# Altium schematic sheet SafeBox(w5100s).SchDoc
size 330 x 241 mm
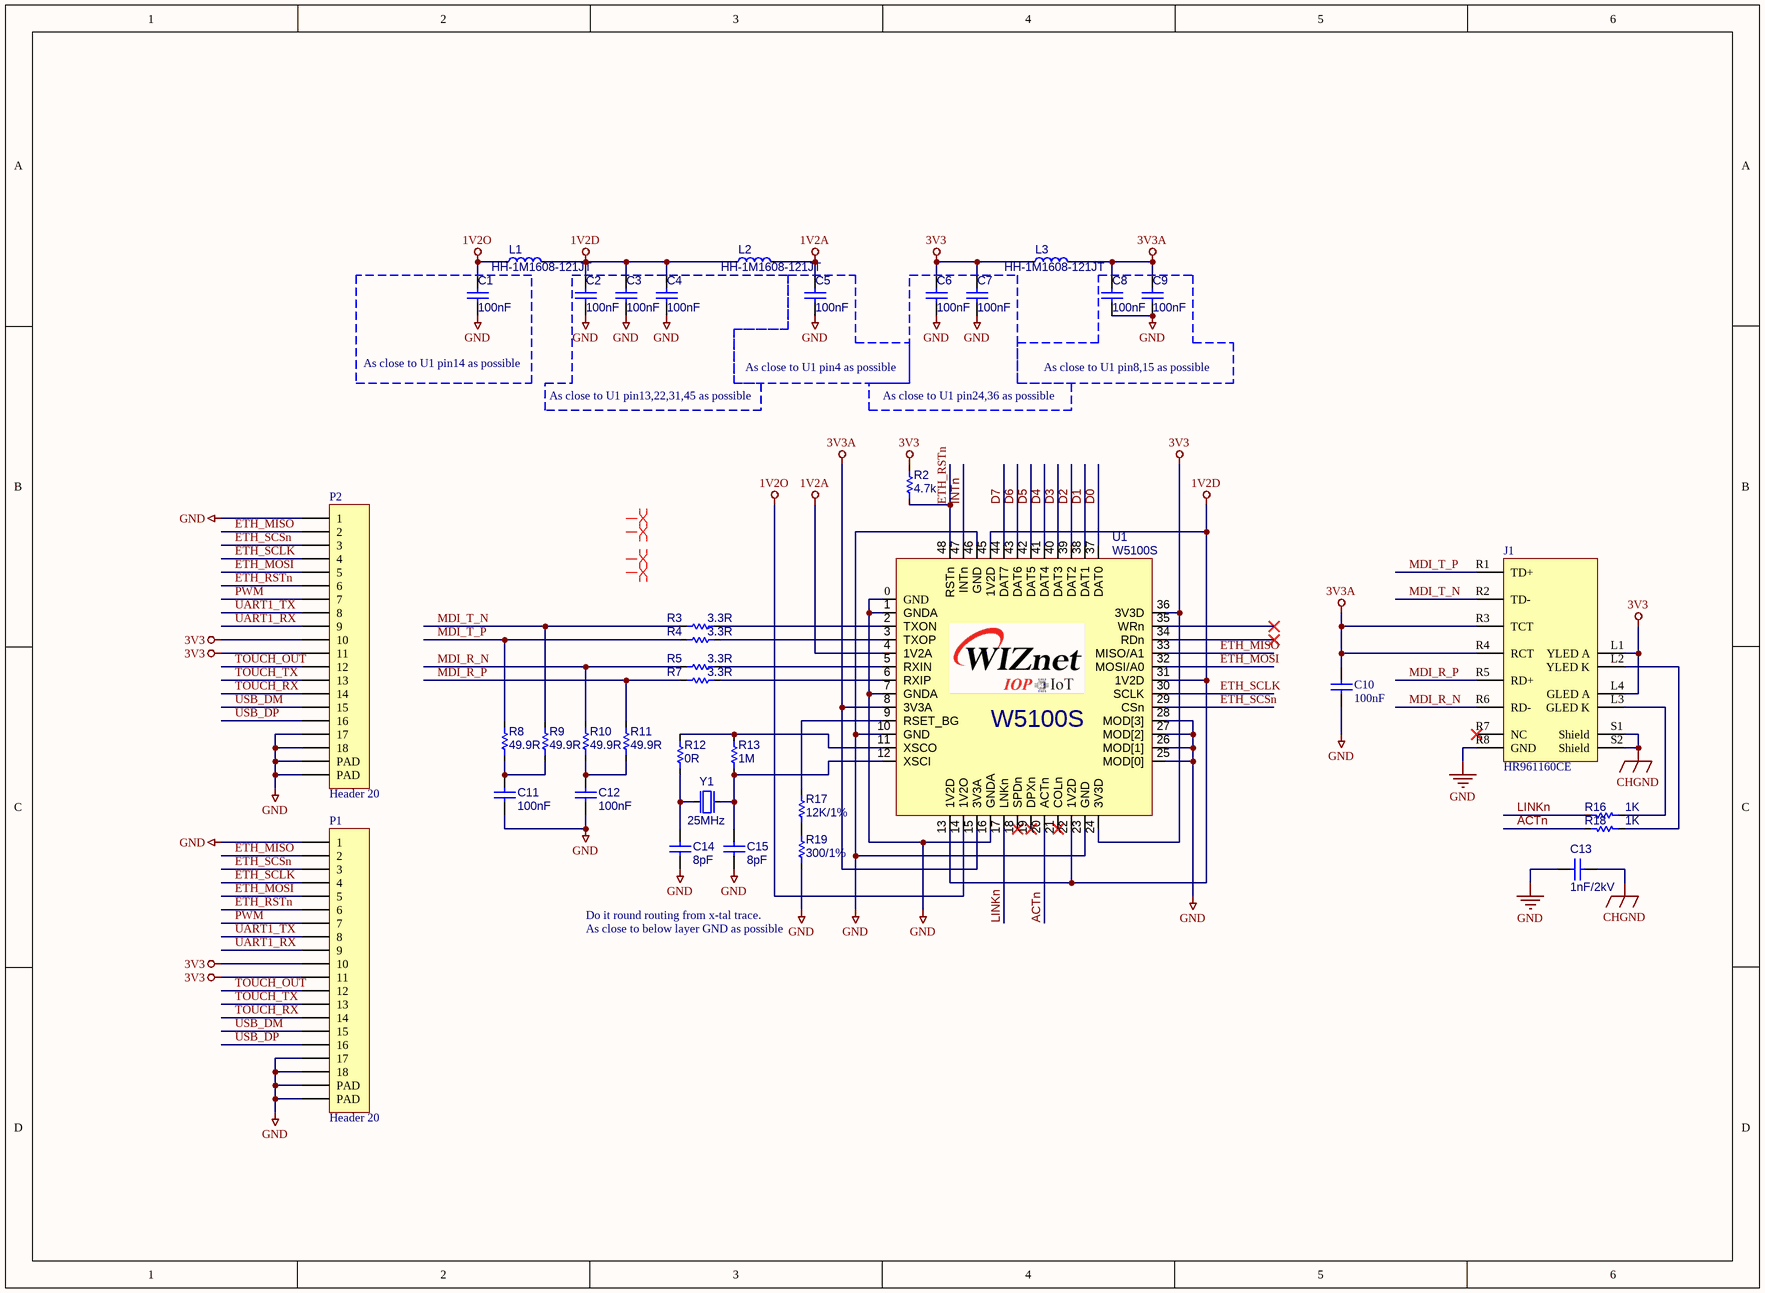
[diagram p0: SafeBox(w5100s).SchDoc]

## Parts
C1  100nF  [0603-C]
C2  100nF  [0603-C]
C3  100nF  [0603-C]
C4  100nF  [0603-C]
C5  100nF  [0603-C]
C6  100nF  [0603-C]
C7  100nF  [0603-C]
C8  100nF  [0603-C]
C9  100nF  [0603-C]
C10  value 100nF  [0603-C]  (hidden comment: Cap)
C11  100nF  [0603-C]
C12  100nF  [0603-C]
C13  1nF/2kV  [CAP-1206]
C14  8pF  [0603-C]
C15  8pF  [0603-C]
J1  HR961160CE  [RJ-45(HR961160CE) - duplicate]
L1  HH-1M1608-121JT  [0603-L]
L2  HH-1M1608-121JT  [0603-L]
L3  HH-1M1608-121JT  [0603-L]
P1  Header 20  [FPC_18PIN]
P2  Header 20  [FPC_18PIN]
R2  4.7k  [0603-R]
R3  3.3R  [0603-R]
R4  3.3R  [0603-R]
R5  3.3R  [0603-R]
R7  3.3R  [0603-R]
R8  49.9R  [0603-R]
R9  49.9R  [0603-R]
R10  49.9R  [0603-R]
R11  49.9R  [0603-R]
R12  0R  [0603-R]
R13  1M  [0603-R]
R16  1K  [0603-R]
R17  12K/1%  [RES-0603]
R18  1K  [0603-R]
R19  300/1%  [RES-0603]
U1  W5100S  [WIZNET W5100S QFN]
Y1  25MHz  [OSC-82J0626]

## Blocks framed on the sheet
As close to U1 pin14 as possible: C1
As close to U1 pin13,22,31,45 as possible: C2-C4
As close to U1 pin4 as possible: C5
As close to U1 pin24,36 as possible: C6 C7
As close to U1 pin8,15 as possible: C8 C9

## Nets
1V2A: C5.2 L2.2 U1.4(1V2A)
1V2D: C2.2 C3.2 C4.2 L1.2 L2.1 U1.13(1V2D) U1.22(1V2D) U1.31(1V2D) U1.45(1V2D)
1V2O: C1.2 L1.1 U1.14(1V2O)
3V3: C6.2 C7.2 J1.L1(YLED_A) J1.L4(GLED_A) L3.1 P1.10 P1.11 P2.10 P2.11 R2.2 U1.24(3V3D) U1.36(3V3D)
3V3A: C8.2 C9.2 C10.1 J1.R3(TCT) J1.R4(RCT) L3.2 U1.8(3V3A) U1.15(3V3A)
CHGND: C13.1 J1.S1(Shield) J1.S2(Shield)
GND: C1.1 C2.1 C3.1 C4.1 C5.1 C6.1 C7.1 C8.1 C9.1 C10.2 C11.1 C12.1 C13.2 C14.1 C15.1 J1.R8(GND) P1.1 P1.17 P1.18 P1.19(PAD) P1.20(PAD) P2.1 P2.17 P2.18 P2.19(PAD) P2.20(PAD) R19.1 U1.0(GND) U1.1(GNDA) U1.7(GNDA) U1.10(GND) U1.16(GNDA) U1.23(GND) U1.25(MOD[0]) U1.26(MOD[1]) U1.27(MOD[2]) U1.28(MOD[3]) U1.46(GND) Y1.2(GND) Y1.4(GND)
ACTn: R18.1 U1.20(ACTn)
D0: U1.37(DAT0)
D1: U1.38(DAT1)
D2: U1.39(DAT2)
D3: U1.40(DAT3)
D4: U1.41(DAT4)
D5: U1.42(DAT5)
D6: U1.43(DAT6)
D7: U1.44(DAT7)
ETH_MISO: P1.2 P2.2 U1.33(MISO/A1)
ETH_MOSI: P1.5 P2.5 U1.32(MOSI/A0)
ETH_RSTn: P1.6 P2.6 R2.1 U1.48(RSTn)
ETH_SCLK: P1.4 P2.4 U1.30(SCLK)
ETH_SCSn: P1.3 P2.3 U1.29(CSn)
INTn: U1.47(INTn)
LINKn: R16.1 U1.17(LNKn)
MDI_R_N: J1.R6(RD-) R5.2 R10.2
MDI_R_P: J1.R5(RD+) R7.2 R11.2
MDI_T_N: J1.R2(TD-) R3.2 R9.2
MDI_T_P: J1.R1(TD+) R4.2 R8.2
PWM: P1.7 P2.7
TOUCH_OUT: P1.12 P2.12
TOUCH_RX: P1.14 P2.14
TOUCH_TX: P1.13 P2.13
UART1_RX: P1.9 P2.9
UART1_TX: P1.8 P2.8
USB_DM: P1.15 P2.15
USB_DP: P1.16 P2.16
NetC11_2: C11.2 R8.1 R9.1
NetC12_2: C12.2 R10.1 R11.1
NetC14_2: C14.2 R12.1 Y1.1(inp)
NetC15_2: C15.2 R13.1 U1.12(XSCI) Y1.3(out)
NetJ1_L2: J1.L2(YLED_K) R18.2
NetJ1_L3: J1.L3(GLED_K) R16.2
NetR3_1: R3.1 U1.2(TXON)
NetR4_1: R4.1 U1.3(TXOP)
NetR5_1: R5.1 U1.5(RXIN)
NetR7_1: R7.1 U1.6(RXIP)
NetR12_2: R12.2 R13.2 U1.11(XSCO)
NetR17_1: R17.1 R19.2
NetR17_2: R17.2 U1.9(RSET_BG)

Not connected (* = marked no-connect by the designer): J1 R7(NC)*; U1 18(SPDn)* 19(DPXn)* 21(COLn)* 34(RDn)* 35(WRn)*

## Layout directives
differential pair: (no net found under the mark)

## Notes on the sheet
- Do it round routing from x-tal trace.
- As close to below layer GND as possible

## Library data of the parts
C1-C9 C11 C12 C14 C15 = CAP-0603: Ceramic CAP 0603(1608)
C10 = Cap: Capacitor; Published: 8-Jun-2000; LatestRevisionDate: 17-Jul-2002; LatestRevisionNote: Re-released for DXP Platform.; PackageReference: RAD-0.3; Publisher: Altium Limited
C13 = CAP-1808: Ceramic CAP 1808(4520)
J1 = BS-R250210
L1-L3 = IND-0603: Inductor 0603(1608)
P1 P2 = Header 20: Header, 20-Pin; LatestRevisionDate: 17-Jul-2002; LatestRevisionNote: Re-released for DXP Platform.; Publisher: Altium Limited
R2-R5 R7-R13 R16-R19 = RES-0603: RES0603
U1 = W5100S: WIZnet Hardwired TCP/IP Chip
Y1 = OSC-82J0626-25MHz: X-tal 25MHz,3.2x2.5 SMD, CL=18pF